# EAGLE design MugTempSensor2.0 (EAGLE 6.0)
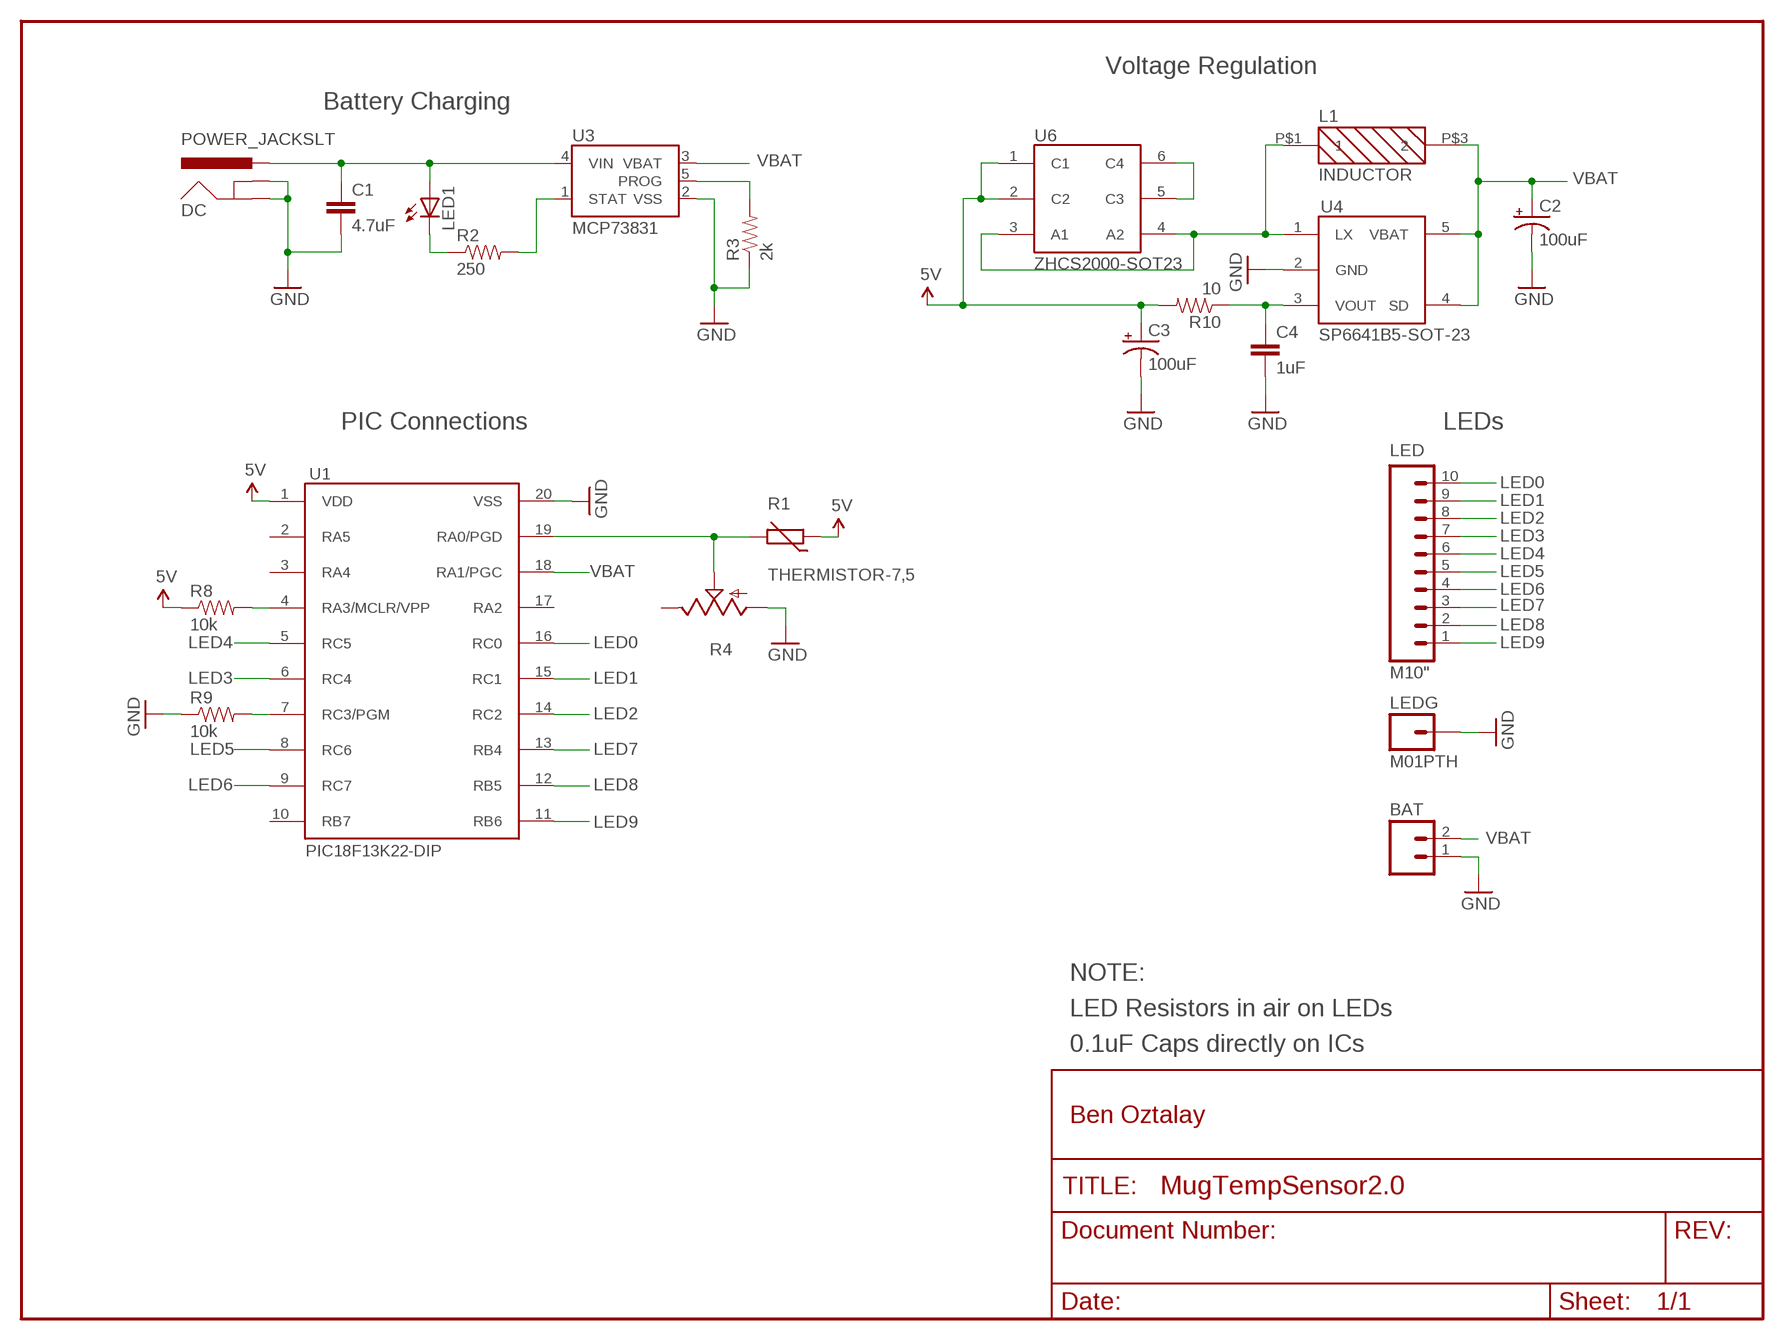
[diagram p0: schematic, sheet 1]

## Parts
BAT  M02PTH  [1X02]
C1  4.7uF  CAPPTH  [CAP-PTH-SMALL]
C2  100uF  CAP_POL7343  [EIA7343]
C3  100uF  CAP_POL7343  [EIA7343]
C4  1uF  CAPPTH  [CAP-PTH-SMALL]
DC  POWER_JACKSLT  [POWER_JACK_SLOT]
L1  INDUCTOR  [IND]
LED  M10"  [1X10]
LED1  LED3MM  [LED3MM]
LEDG  M01PTH  [1X01]
R1  THERMISTOR-7,5  [R-7,5]
R2  250  RESISTORKIT  [AXIAL-0.3-KIT]
R3  2k  RESISTORKIT  [AXIAL-0.3-KIT]
R4  TRIM_US-B64Y  [B64Y]
R8  10k  RESISTORKIT  [AXIAL-0.3-KIT]
R9  10k  RESISTORKIT  [AXIAL-0.3-KIT]
R10  10  RESISTORKIT  [AXIAL-0.3-KIT]
U1  PIC18F13K22-DIP  [DIP-20-300MIL]
U3  MCP73831  [SOT23-5]
U4  SP6641B5-SOT-23  [SOT-23-5]
U6  ZHCS2000-SOT23  [SOT-23-6]

## Nets
5V: C3.A(+) R1.1 R8.P$1 R10.P$2 U1.1(VDD) U6.1(C1) U6.2(C2)
GND: BAT.1 C1.2 C2.C(-) C3.C(-) C4.2 DC.GND@1(GNDBREAK) DC.GND@2(GND) LEDG.1 R3.P$1 R4.A R9.P$1 U1.20(VSS) U3.2(VSS) U4.2(GND)
LED0: LED.10 U1.16(RC0)
LED1: LED.9 U1.15(RC1)
LED2: LED.8 U1.14(RC2)
LED3: LED.7 U1.6(RC4)
LED4: LED.6 U1.5(RC5)
LED5: LED.5 U1.8(RC6)
LED6: LED.4 U1.9(RC7)
LED7: LED.3 U1.13(RB4)
LED8: LED.2 U1.12(RB5)
LED9: LED.1 U1.11(RB6)
N$1: C1.1 DC.PWR LED1.A U3.4(VIN)
N$2: LED1.K(C) R2.P$1
N$3: R2.P$2 U3.1(STAT)
N$4: R3.P$2 U3.5(PROG)
N$8: R8.P$2 U1.4(RA3/MCLR/VPP)
N$9: R9.P$2 U1.7(RC3/PGM)
N$10: L1.P$1 U4.1(LX) U6.3(A1) U6.4(A2)
N$11: U6.5(C3) U6.6(C4)
N$13: C4.1 R10.P$1 U4.3(VOUT)
N$20: R1.2 R4.S U1.19(RA0/PGD)
VBAT: BAT.2 C2.A(+) L1.P$3 U1.18(RA1/PGC) U3.3(VBAT) U4.4(SD) U4.5(VBAT)
Unconnected: R4.E U1.2(RA5) U1.3(RA4) U1.10(RB7) U1.17(RA2)

## Notes on the sheet
- Voltage Regulation
- Battery Charging
- PIC Connections | LEDs
- NOTE:
- LED Resistors in air on LEDs
- 0.1uF Caps directly on ICs
- Ben Oztalay

## Library data of the parts
BAT = SparkFun:M02: Header 2 Standard 2-pin 0.1" header. Use with straight break away headers (SKU : PRT-00116), right angle break away headers (PRT-00553), swiss pins (PRT-00743), machine pins (PRT-00117), and female headers (PRT-00115). Molex polarized connector foot print use with SKU : PRT-08233 with associated crimp pins and housings.
C1 C4 = SparkFun:CAP: Capacitor Standard 0603 ceramic capacitor, and 0.1" leaded capacitor.
C2 C3 = SparkFun:CAP_POL: Capacitor Polarized These are standard SMD and PTH capacitors. Normally 10uF, 47uF, and 100uF in electrolytic and tantalum varieties. Always verify the external diameter of the through hole cap, it varies with capacity, voltage, and manufacturer. The EIA devices should be standard.
DC = SparkFun:POWER_JACK: Power Jack This is the standard 5.5mm barrel jack for power. The PTH is the most common, proven, reliable, footprint. All others are experimental. The Slot footprint only works if the mill layer is transmitted to the PCB fab house so be warned. Spark Fun Electronics SKU : PRT-00119. Mating wall wart : TOL-00298 (and others)
L1 = boztalay:INDUCTOR
LED = SparkFun:M10: Header 10 Standard 10-pin 0.1" header. Use with straight break away headers (SKU : PRT-00116), right angle break away headers (PRT-00553), swiss pins (PRT-00743), machine pins (PRT-00117), and female headers (PRT-00115).
LED1 = SparkFun:LED: LEDs Standard schematic elements and footprints for 5mm, 3mm, 1206, and 0603 sized LEDs. 5mm - Spark Fun Electronics SKU : COM-00529 (and others)
LEDG = SparkFun:M01: Header 1 Standard 1-pin 0.1" header. Use with straight break away headers (SKU : PRT-00116), right angle break away headers (PRT-00553), swiss pins (PRT-00743), machine pins (PRT-00117), and female headers (PRT-00115).
R1 = varistor:THERMISTOR: THERMISTOR
R2 R3 R8-R10 = SparkFun:RESISTOR: Resistor Basic schematic elements and footprints for 0603, 1206, and PTH resistors.
R4 = pot:TRIM_US-: POTENTIOMETER
U1 = boztalay:PIC18F13K22-DIP
U3 = SparkFun:MCP73831: Microchip's MCP73831 Miniature single cell, fully integrated Li-Ion, Li-polymer charge management controller http://ww1.microchip.com/downloads/en/DeviceDoc/21984a.pdf
U4 = boztalay:SP6641B5-SOT-23
U6 = boztalay:ZHCS2000-SOT23

## Board
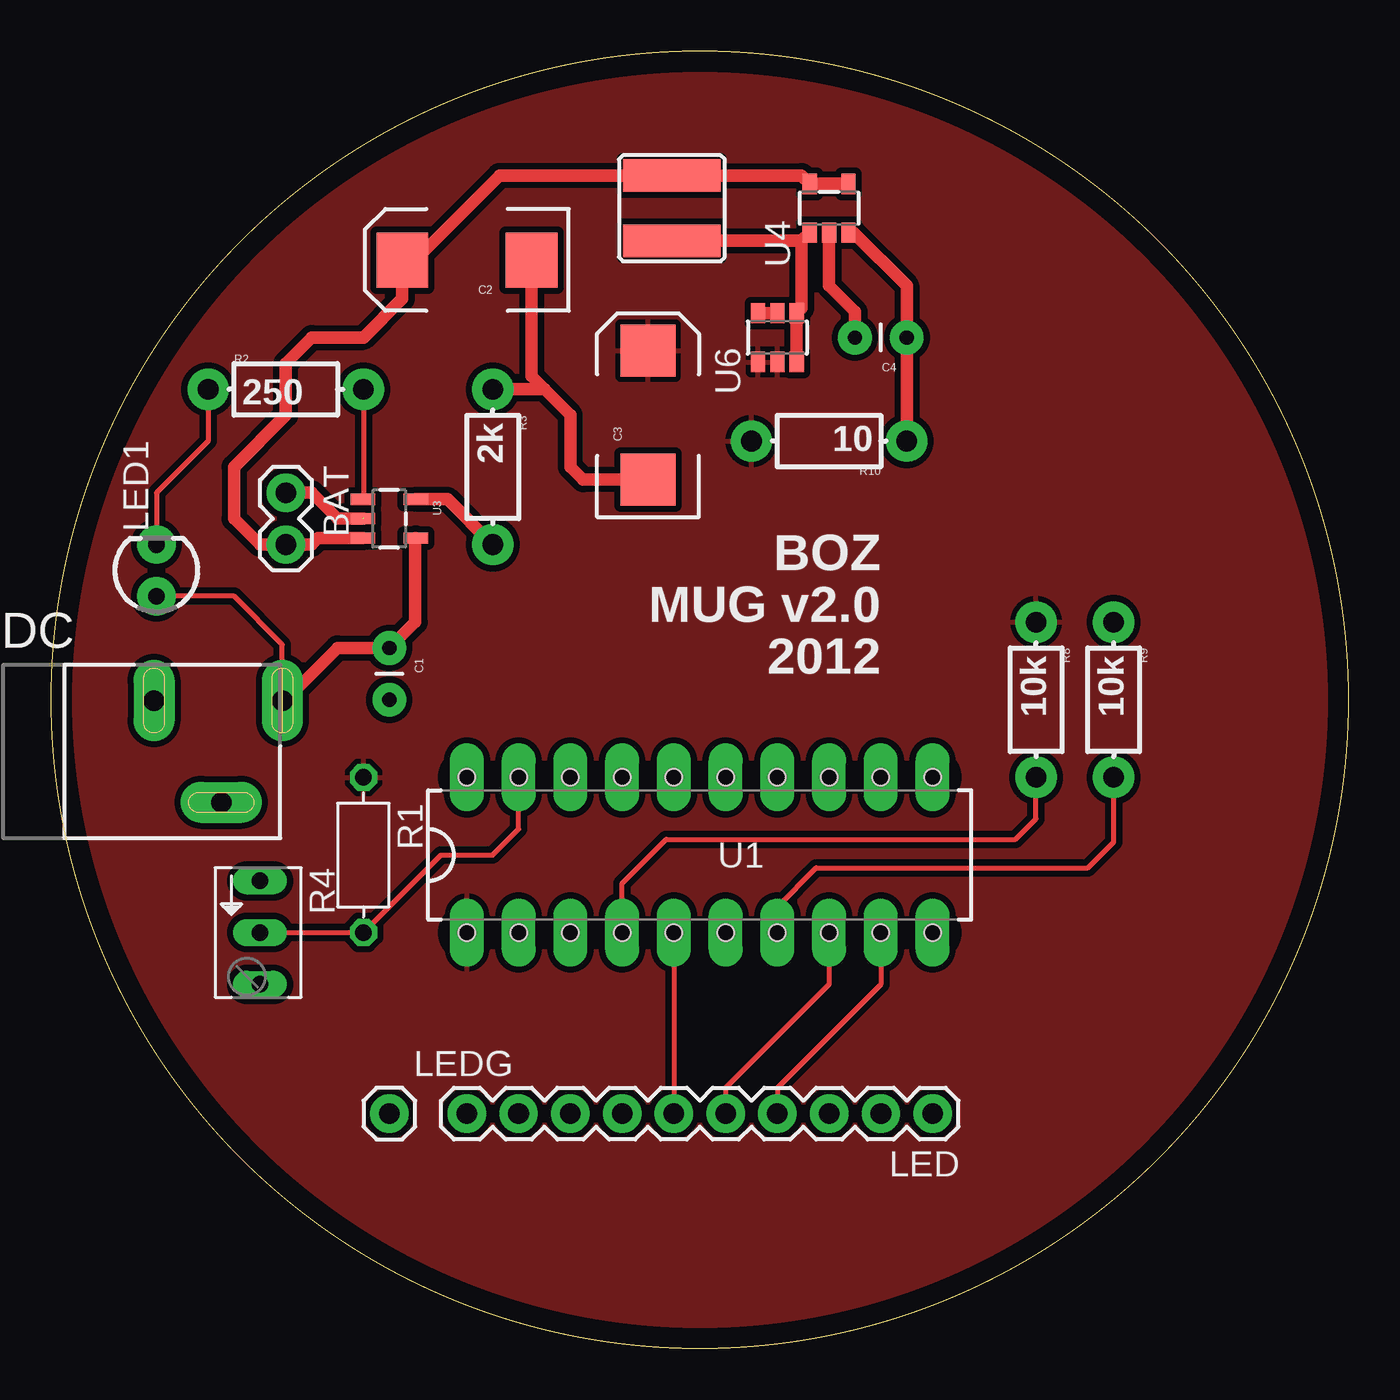
[diagram p1: board, top side]
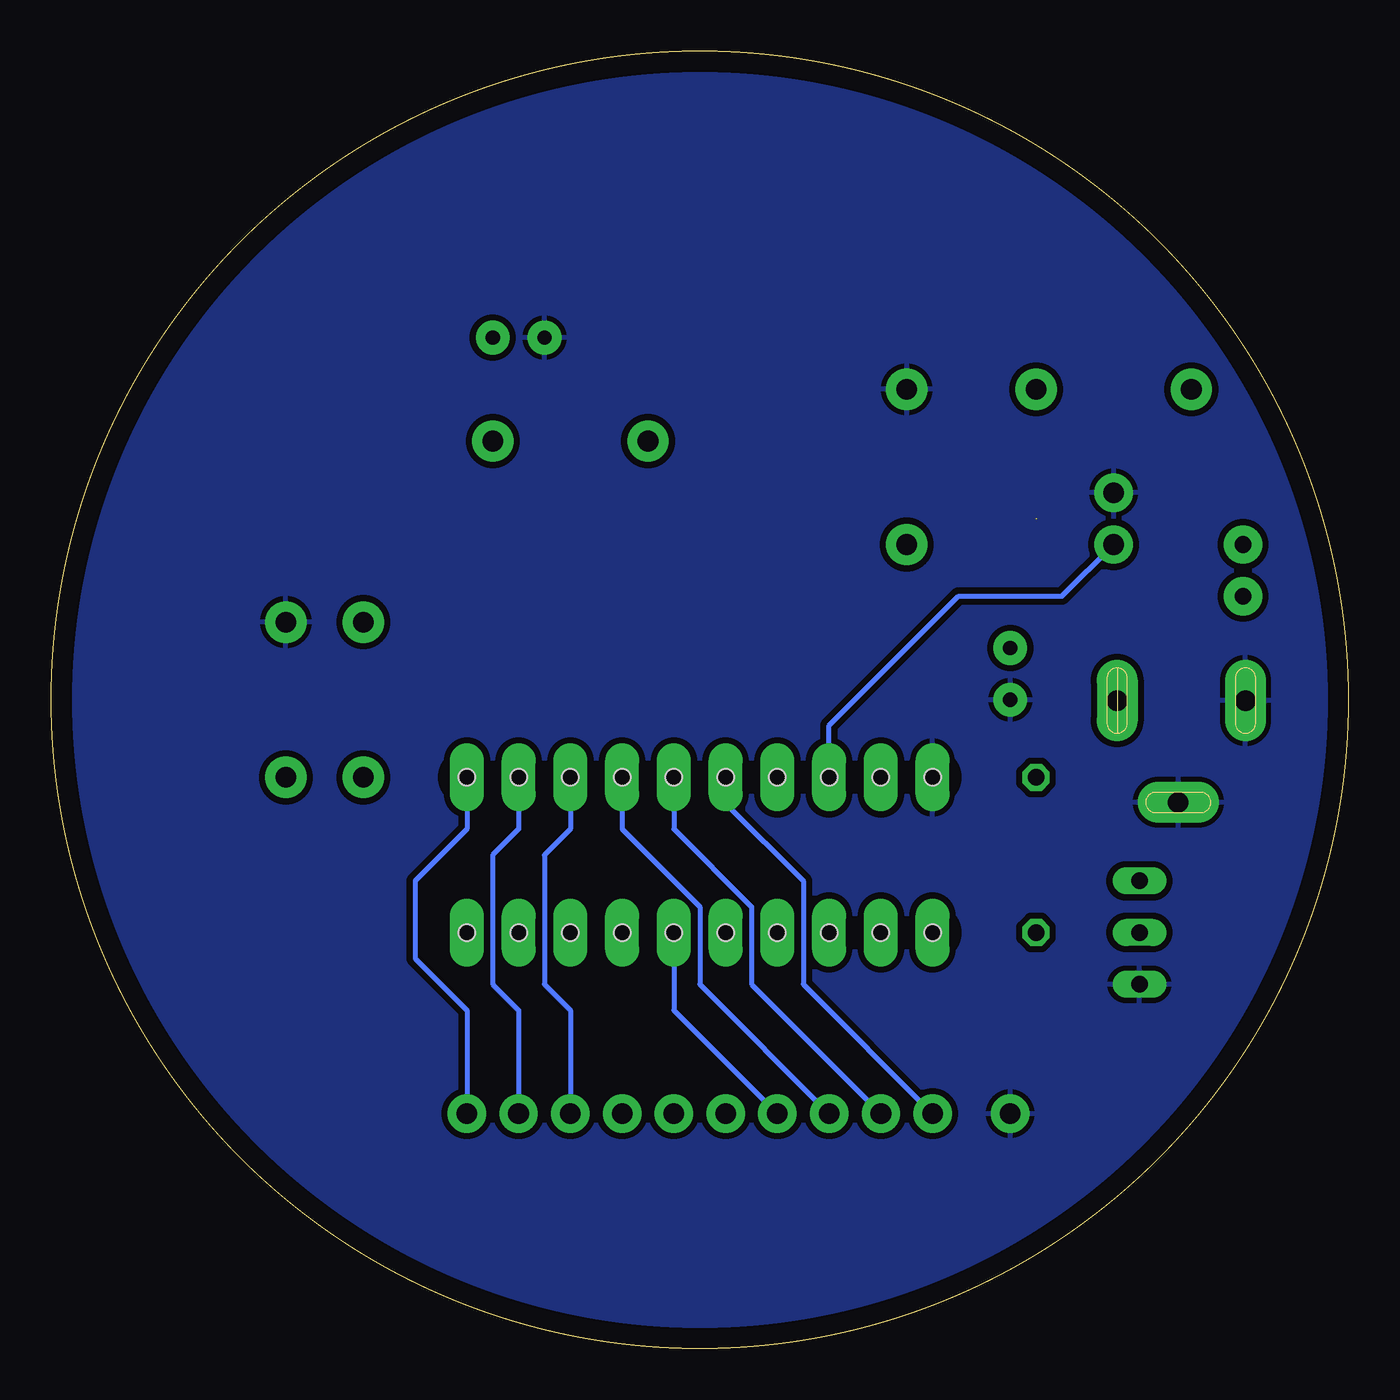
[diagram p2: board, bottom side, seen from below]

Size 63.7 x 63.7 mm. Coordinates in mm from the lower left corner, seen from the top.
Outline: circle at 31.85,31.85 radius 31.85
Copper layers (1*16): Top 0.035mm / dielectric 1.5mm / Bottom 0.035mm
Design rules: minimum track width 10mil, minimum drill 24mil, track to track 8mil, track to pad 8mil, pad to pad 8mil, via to via 8mil, smd to smd 8mil, copper to edge 40mil, drill to drill 8mil, minimum pad ring 10mil, minimum via ring 8mil, stop-mask expansion 4mil, vias tented up to drill 0mil, thermal gap 10mil

### Footprints (pad centres in the part's own frame; a part is rotated, then mirrored left to right if it is on the bottom)
1X02 = drill 1.016 pad 1.88: 1 0,0; 2 2.54,0
CAP-PTH-SMALL = drill 0.7 pad 1.651: 1 0,0; 2 2.54,0
EIA7343 = smd 2.55 x 2.7: A 3.17,0; C -3.17,0
POWER_JACK_SLOT = drill 1 pad 2 long: GND@1 2.58,7.5; GND@2 7.58,10.8; PWR 2.58,13.8
IND = smd 4.8 x 1.6: P$1 0.1,1.6; P$3 0.1,-1.6
1X10 = drill 1.016 pad 1.88: 1 0,0; 2 2.54,0; 3 5.08,0; 4 7.62,0; 5 10.16,0; 6 12.7,0; 7 15.24,0; 8 17.78,0; 9 20.32,0; 10 22.86,0
LED3MM = drill 0.813 pad 1.88: A -1.27,0; K 1.27,0
1X01 = drill 1.016 pad 1.88: 1 0,0
R-7,5 = drill 0.813 octagon: 1 -3.81,0; 2 3.81,0
AXIAL-0.3-KIT = drill 1.016 pad 2.032: P$1 -3.81,0; P$2 3.81,0
B64Y = drill 0.813 long: A 2.54,0; E -2.54,0; S 0,0
DIP-20-300MIL = drill 0.8 pad 1.676 long: 1 -3.81,11.43; 2 -3.81,8.89; 3 -3.81,6.35; 4 -3.81,3.81; 5 -3.81,1.27; 6 -3.81,-1.27; 7 -3.81,-3.81; 8 -3.81,-6.35; 9 -3.81,-8.89; 10 -3.81,-11.43; 11 3.81,-11.43; 12 3.81,-8.89; 13 3.81,-6.35; 14 3.81,-3.81; 15 3.81,-1.27; 16 3.81,1.27; 17 3.81,3.81; 18 3.81,6.35; 19 3.81,8.89; 20 3.81,11.43 | hole 0.8: -3.81,11.43; -3.81,8.89; -3.81,6.35; -3.81,3.81; -3.81,1.27; -3.81,-1.27; -3.81,-3.81; -3.81,-6.35; -3.81,-8.89; -3.81,-11.43; 3.81,-11.43; 3.81,-8.89; 3.81,-6.35; 3.81,-3.81; 3.81,-1.27; 3.81,1.27; 3.81,3.81; 3.81,6.35; 3.81,8.89; 3.81,11.43
SOT23-5 = smd 0.55 x 1.2: 1 -0.95,-1.3; 2 0,-1.3; 3 0.95,-1.3; 4 0.95,1.3; 5 -0.95,1.3
SOT-23-5 = smd 0.7 x 1: 1 -0.95,-1.2; 2 0,-1.2; 3 0.95,-1.2; 4 0.95,1.2; 5 -0.95,1.2
SOT-23-6 = smd 0.7 x 1: 1 -0.95,-1.2; 2 0,-1.2; 3 0.95,-1.2; 4 0.95,1.2; 5 0,1.2; 6 -0.95,1.2

### Placement (x,y rotation side)
BAT  11.53,42.01 270 top
C1  16.61,34.39 270 top
C2  20.42,53.44 180 top
C3  29.31,45.82 90 top
C4  42.01,49.63 180 top
DC  -2.44,34.39 270 top
L1  30.58,55.98 180 top
LED  43.28,11.53 180 top
LED1  5.18,38.2 90 top
LEDG  16.61,11.53 0 top
R1  15.34,24.23 270 top
R2  11.53,47.09 0 top
R3  21.69,43.28 270 top
R4  10.26,20.42 270 top
R8  48.36,31.85 270 top
R9  52.17,31.85 270 top
R10  38.2,44.55 180 top
U1  31.85,24.23 90 top
U3  16.61,40.74 270 top
U4  38.2,55.98 0 top
U6  35.66,49.63 0 top

### Tracks (layer width: path | path; a pad name or v marks a point on that pad's centre or on a via)
5V
  pour Top (isolate 0.305): 0.1,0.1 63.6,0.1 63.6,63.6 0.1,63.6
GND  (1 unrouted)
  Top 0.61: C3.C 26.13,42.65 25.5,43.28 25.5,45.82 24.23,47.09 | 24.23,47.09 R3.P$1 | U4.2 38.2,52.17 39.47,50.9 C4.2 | BAT.1 12.8,42.01 14.07,40.74 15.34,40.74 | C2.C 23.59,47.73 24.23,47.09
  pour Bottom (isolate 0.305): 0.1,0.1 63.6,0.1 63.6,63.6 0.1,63.6
LED0
  Bottom 0.254: U1.16 30.58,26.77 26.77,22.96 26.77,17.88 LED.10
LED1
  Bottom 0.254: U1.15 33.12,25.5 29.31,21.69 29.31,17.88 LED.9
LED2
  Bottom 0.254: U1.14 35.66,25.5 31.85,21.69 31.85,17.88 LED.8
LED3
  Bottom 0.254: U1.6 33.12,16.61 LED.7
LED4
  Top 0.254: U1.5 LED.6
LED5
  Top 0.254: U1.8 38.2,17.88 33.12,12.8 LED.5
LED6
  Top 0.254: U1.9 40.74,17.88 35.66,12.8 LED.4
LED7
  Bottom 0.254: U1.13 38.2,25.5 39.47,24.23 39.47,17.88 38.2,16.61 LED.3
LED8
  Bottom 0.254: U1.12 40.74,25.5 42.01,24.23 42.01,17.88 40.74,16.61 LED.2
LED9
  Bottom 0.254: U1.11 43.28,25.5 45.82,22.96 45.82,19.15 43.28,16.61 LED.1
N$1
  Top 0.254: LED1.A 8.99,36.93 11.36,34.56 DC.PWR
  Top 0.61: 16.57,34.35 C1.1 | C1.1 17.88,35.66 17.88,39.76 U3.4 | DC.PWR 11.49,31.81 14.07,34.39 C1.1
N$2
  Top 0.254: R2.P$1 7.72,44.55 5.18,42.01 LED1.K
N$3
  Top 0.254: R2.P$2 15.34,41.72 U3.1
N$4
  Top 0.61: U3.5 19.47,41.69 R3.P$2
N$8
  Top 0.254: U1.4 28.04,22.83 30.2,24.99 47.35,24.99 48.36,26.01 R8.P$2
N$9
  Top 0.254: U1.7 35.66,21.69 37.57,23.6 50.9,23.6 52.17,24.87 R9.P$2
N$10
  Top 0.61: L1.P$1 36.85,54.38 | 36.85,54.38 U4.1 | 36.85,54.38 36.85,51.07 U6.4 U6.3
N$11
  Top 0.61: U6.5 U6.6
N$13
  Top 0.61: U4.3 39.4,54.78 42.01,52.17 C4.1 R10.P$1
N$20
  Top 0.254: R4.S R1.2 19.15,24.23 21.69,24.23 22.96,25.5 U1.19
VBAT
  Top 0.61: U4.4 U4.5 36.85,57.58 L1.P$3 22.02,57.58 17.88,53.44 C2.A 17.25,51.54 15.34,49.63 12.8,49.63 11.53,48.36 11.53,45.82 8.99,43.28 8.99,40.74 10.26,39.47 BAT.2 12.8,39.47 13.12,39.79 U3.3
  Bottom 0.254: U1.18 25.5,30.58 19.15,36.93 14.07,36.93 BAT.2

### Text on the board
tPlace: BOZ | MUG v2.0 | 2012